# EAGLE design CSv1_LoRa_exp_board (EAGLE 9.5.1)
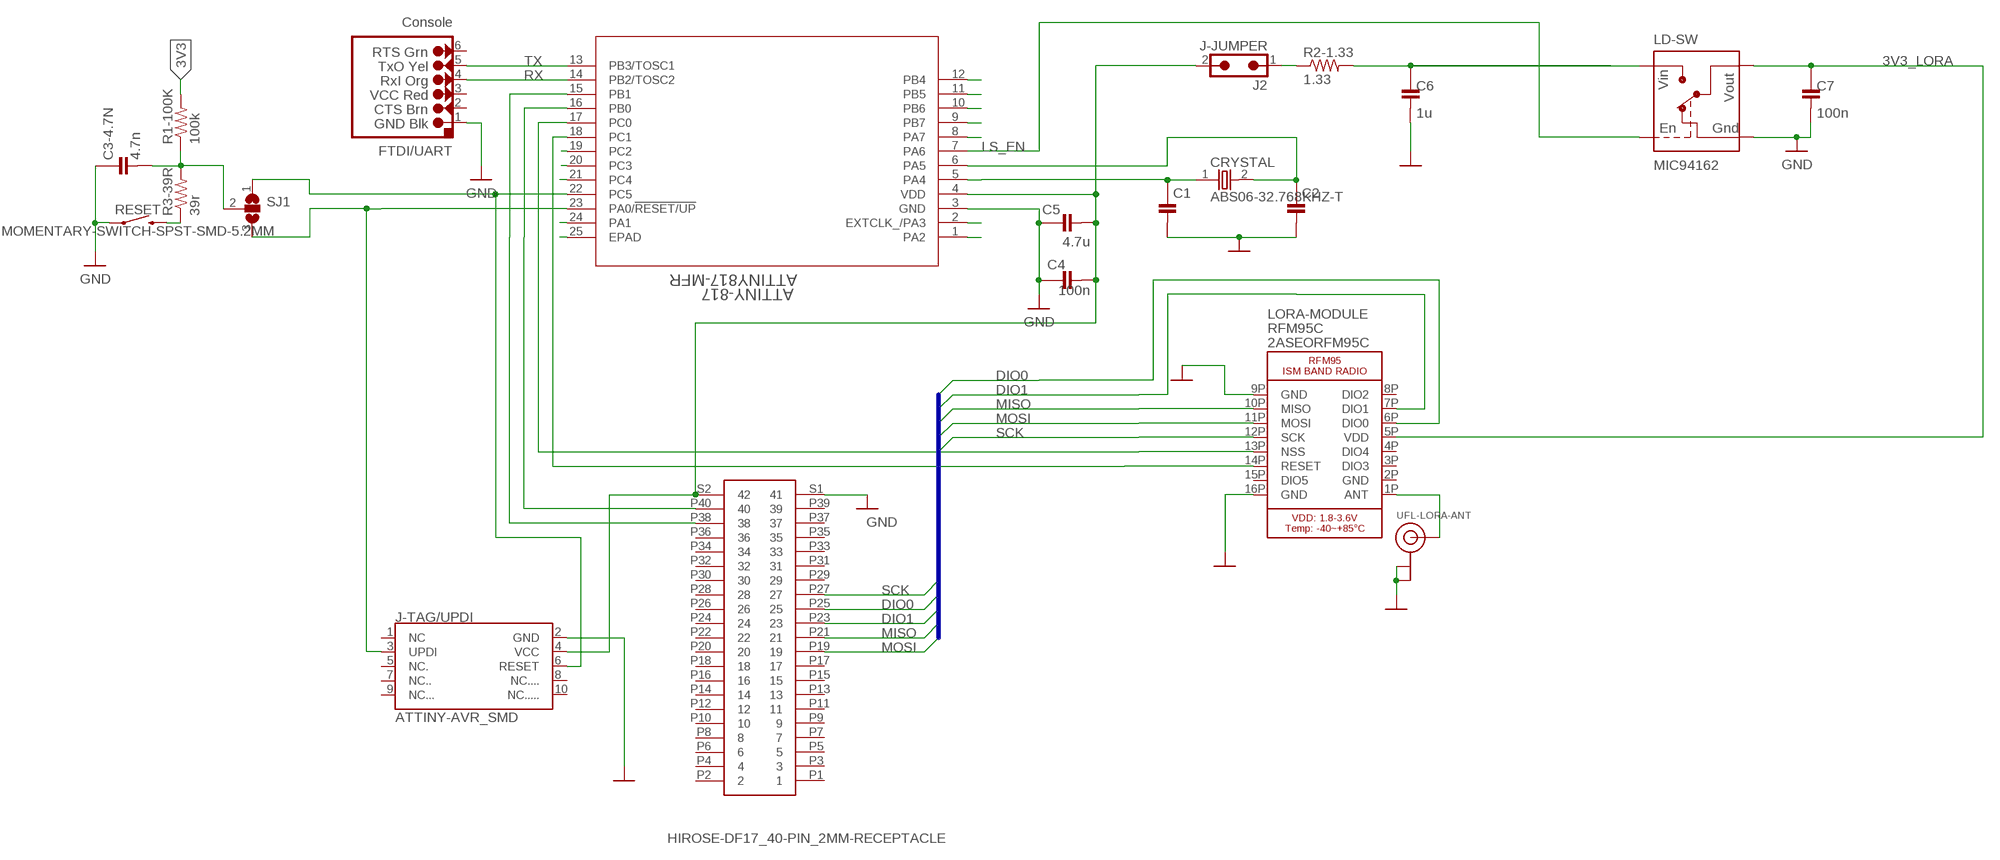
[diagram p0: schematic, sheet 1]

## Parts
ATTINY-817  ATTINY817-MFR  [QFN24_4X4MC]
C1  C-0402  [C0402]
C2  C-0402  [C0402]
C3-4.7N  4.7n  C-0603  [C0603]
C4  100n  C-0402  [C0402]
C5  4.7u  C-0402  [C0402]
C6  1u  C-0402  [C0402]
C7  100n  C-0402  [C0402]
CRYSTAL  ABS06-32.768KHZ-T  [XTAL_ABS06-32.768KHZ-T]
FTDI/UART  J-SERIAL-PORT  [HEADER-1X6]
J1  HIROSE-DF17_40-PIN_2MM-RECEPTACLE  HIROSE-DF17_40-PIN_CONNECTORS-HRS_DF17-40PIN-PLUG  [HRS_DF17-40PIN-PLUG]
J2  J-JUMPER  [HEADER-1X2]
J-TAG/UPDI  ATTINY-AVR_SMD  [ATTINY_AVR]
LD-SW  LOADSWITCH-MIC94162  [WLCSP6_2X3]
LORA-MODULE  RFM95C  [RFM-MOD]
R1-100K  100k  R-0603  [R0603]
R2-1.33  1.33  R-0603  [R0603]
R3-39R  39r  R-0603  [R0603]
RESET  MOMENTARY-SWITCH-SPST-SMD-5.2MM  [TACTILE_SWITCH_SMD_5.2MM]
SJ1  SJ2WW  [SJ_2W]
UFL-LORA-ANT  J-U.FL  [U.FL]

## Nets
3V3 [power_3v3]: ATTINY-817.4(VDD) C4.2 C5.2 J1.S2 J2.2 J-TAG/UPDI.4(VCC) R1-100K.2
3V3_LORA [power_3v3]: C7.1 LD-SW.A1(VOUT) LD-SW.B1(VOUT) LORA-MODULE.5P(VDD)
3V_LD_SW [power_3v3]: C6.1 LD-SW.A2(VIN) LD-SW.B2(VIN) R2-1.33.2
DIO0: J1.P25 LORA-MODULE.6P(DIO0)
DIO1: J1.P23 LORA-MODULE.7P(DIO1)
EPAD: ATTINY-817.25(EPAD)
GND [power_3v3]: ATTINY-817.3(GND) C1.2 C2.2 C3-4.7N.1 C4.1 C5.1 C6.2 C7.2 FTDI/UART.1(GND) J1.S1 J-TAG/UPDI.2(GND) LD-SW.C1(GND) LORA-MODULE.9P(GND) LORA-MODULE.16P(GND) RESET.1 UFL-LORA-ANT.1(GND) UFL-LORA-ANT.2(GND)
LORA_JMP1 [power_3v3]: J2.1 R2-1.33.1
LS_EN: ATTINY-817.7(PA6) LD-SW.C2(ENABLE)
MISO: J1.P21 LORA-MODULE.10P(MISO)
MOSI: J1.P19 LORA-MODULE.11P(MOSI)
N$6: LORA-MODULE.1P(ANT) UFL-LORA-ANT.3(SIGNAL)
N$12: R3-39R.1 RESET.3
N$13: C3-4.7N.2 R1-100K.1 R3-39R.2 SJ1.2
PA0: ATTINY-817.23(PA0/!RESET/UP) J-TAG/UPDI.3(UPDI) SJ1.3
PA1: ATTINY-817.24(PA1)
PA2: ATTINY-817.1(PA2)
PA3: ATTINY-817.2(EXTCLK_/PA3)
PA4: ATTINY-817.5(PA4) C1.1 CRYSTAL.1
PA5: ATTINY-817.6(PA5) C2.1 CRYSTAL.2
PA7: ATTINY-817.8(PA7)
PB0: ATTINY-817.16(PB0) J1.P40
PB4: ATTINY-817.12(PB4)
PB5: ATTINY-817.11(PB5)
PB6: ATTINY-817.10(PB6)
PB7: ATTINY-817.9(PB7)
PC0: ATTINY-817.17(PC0) LORA-MODULE.13P(NSS)
PC1: ATTINY-817.18(PC1) LORA-MODULE.14P(RESET)
PC2: ATTINY-817.19(PC2)
PC3: ATTINY-817.20(PC3)
PC4: ATTINY-817.21(PC4)
PC5: ATTINY-817.22(PC5) J-TAG/UPDI.6(RESET) SJ1.1
RX: ATTINY-817.14(PB2/TOSC2) FTDI/UART.4(RX-I)
SCK: J1.P27 LORA-MODULE.12P(SCK)
SDA: ATTINY-817.15(PB1) J1.P38
TX: ATTINY-817.13(PB3/TOSC1) FTDI/UART.5(TX-O)
Unconnected: FTDI/UART.2(CTS-O) FTDI/UART.3(VCC-I) FTDI/UART.6(RTS) J1.P1 J1.P2 J1.P3 J1.P4 J1.P5 J1.P6 J1.P7 J1.P8 J1.P9 J1.P10 J1.P11 J1.P12 J1.P13 J1.P14 J1.P15 J1.P16 J1.P17 J1.P18 J1.P20 J1.P22 J1.P24 J1.P26 J1.P28 J1.P29 J1.P30 J1.P31 J1.P32 J1.P33 J1.P34 J1.P35 J1.P36 J1.P37 J1.P39 J-TAG/UPDI.1(NC) J-TAG/UPDI.5(NC.) J-TAG/UPDI.7(NC..) J-TAG/UPDI.8(NC....) J-TAG/UPDI.9(NC...) J-TAG/UPDI.10(NC.....) LORA-MODULE.3P(DIO3) LORA-MODULE.4P(DIO4) LORA-MODULE.8P(DIO2) LORA-MODULE.15P(DIO5)

## Buses
DIO0,DIO1,MISO,MOSI,SCK

## Power pins joined to a net without a drawn wire
GND: LORA-MODULE.2P(GND)

## Library data of the parts
ATTINY-817 = ATTINY817-MFRQFN24_RX4MC-L:ATTINY817-MFR; MANUFACTURER_PART_NUMBER: ATTINY817MFR; VENDOR: Microchip
C1 C2 C3-4.7N = Capacitors:C-: Capacitor, Surface Mount; MANUFACTURER: Kemet; TC: X7R; TOL: 10%; VOLTAGE: 6.3V
C4-C6 = Capacitors:C-: Capacitor, Surface Mount; MANUFACTURER: Kemet; PARTNO: CC0402KRX5R5BB105; TC: X7R; TOL: 10%; VOLTAGE: 6.3V
C7 = Capacitors:C-: Capacitor, Surface Mount; MANUFACTURER: Kemet; PARTNO: CC0402KRX5R5BB104; TC: X7R; TOL: 10%; VOLTAGE: 6.3V
CRYSTAL = Oscillators:ABS06-32.768KHZ-T: ABS06 Series 32.768 kHz ±10 ppm 9 pF -40 to +85 °C SMT Low Profile Crystal. Footprint verified by Reese Grimsley; DESCRIPTION: ABS06 Series 32.768 kHz ±10 ppm 12.5 pF -40 to +85 °C SMT Low Profile Crystal; DIGI-KEY_PART_NUMBER: 535-10247-1-ND; DIGI-KEY_PURCHASE_URL: https://www.digikey.com/product-detail/en/abracon-llc/ABS06-32.768KHZ-9-1-T/535-10247-1-ND/2218060; MF: Abracon; MP: ABS06-32.768KHZ-9-1-T ABS06-32.768KHZ-9-1-T; PACKAGE: SMD-2 Abracon
FTDI/UART = Connectors:J-SERIAL-PORT: An Arduino-style serial port connector. Mates with the corresponding FTDI USB Serial cable. The attribute "DESCRIPTION" can be set to a string that will show on the schematic and the silkscreen.; DESCRIPTION: Console; MANUFACTURER: Metz Connect USA; MPN: PR20C06VBNN
J1 = Connectors:HIROSE-DF17_40-PIN_CONNECTORS: Hirose DF17 Series 0.5mm Pitch 40 Way 2 Row Straight PCB Socket, Surface Mount, Solder Termination Updated Footprints: ###-PLUG, ###-SOCKETS (pins are mirrored L/R) Footprints apply to all heights (e.g. HRS_DF17(#.#)-40D....) Updated by Scotty 18NOV2019 Source: Datasheet <https://componentsearchengine.com/Datasheets/1/DF17(4.0)-40DS-0.5V(57).pdf>
J2 = Connectors:J-JUMPER: JUMPER; DESCRIPTION: JMP_LORA
J-TAG/UPDI = scotty:ATTINY-AVR: Cortex Debug Connector - 10 pin Supports JTAG debug, Serial Wire debug, and Serial Wire Viewer. PTH and SMD connector options available. General Connector Information <http://infocenter.arm.com/help/topic/com.arm.doc.faqs/attached/13634/cortex_debug_connectors.pdf> Products: PTH Connector <http://www.digikey.com/product-detail/en/cnc-tech/3220-10-0100-00/1175-1627-ND/3883661> -via Digi-Key SparkFun PSoc <https://www.sparkfun.com/products/13229> SparkFun T <https://www.sparkfun.com/products/13810>; MANUFACTURER: Samtech Inc.; MPN: FTSH-105-01-L-DV-K-TR
LD-SW = Switches:LOADSWITCH-MIC9416: MICREL 3A HIGH-SIDE LOAD SWITCH WITH REVERSE BLOCKING http://ww1.microchip.com/downloads/en/DeviceDoc/MIC9416x.pdf https://www.digikey.com/product-detail/en/microchip-technology/MIC94162YCS-TR/576-4508-1-ND/4732487; MANUFACTURER: Microchip Technology; MPN: MIC94162YCS-TR; PARTNO: MIC94162; QUENCH: YES; SOFTSTART: NO
LORA-MODULE = Radios:RFM95: RFM95 - ISM Band LoRa Transceiver; FCC: 2ASEORFM95C; MANUFACTURER: HopeRF; MPN: RFM95C
R1-100K R3-39R = Resistors:R-: Resistor, Surface Mount; MANUFACTURER: Panasonic; TOL: 5%
R2-1.33 = Resistors:R-: Resistor, Surface Mount; MANUFACTURER: Panasonic; PARTNO: CRCW06031R33FKEA; TOL: 5%
RESET = Switches:MOMENTARY-SWITCH-SPST: Momentary Switch (Pushbutton) - SPST Normally-open (NO) SPST momentary switches (buttons, pushbuttons). Variants PTH-12MM - 12mm square, through-hole Momentary Pushbutton Switch - 12mm Square <https://www.sparkfun.com/products/9190> (COM-09190) PTH-6.0MM, PTH-6.0MM-KIT - 6.0mm square, through-hole Mini Pushbutton Switch <https://www.sparkfun.com/products/97> (COM-00097) KIT package intended for soldering kit's - only one side of pads' copper is exposed. PTH-RIGHT-ANGLE-KIT - Right-angle, through-hole Right Angle Tactile Button <https://www.sparkfun.com/products/10791> - Used on SparkFun BigTime Watch Kit <https://www.sparkfun.com/products/11734> SMD-12MM - 12mm square, surface-mount Tactile Button - SMD (12mm) <https://www.sparkfun.com/products/12993> (COM-12993) Used on SparkFun PicoBoard <https://www.sparkfun.com/products/11888> SMD-4.5MM - 4.5mm Square Trackball Switch Used on SparkFun Blackberry Trackballer Breakout <https://www.sparkfun.com/products/13169> SMD-4.6MMX2.8MM - 4.60mm x 2.80mm, surface mount Used on SparkFun SAMD21 Mini Breakout <https://www.sparkfun.com/products/13664> SMD-5.2MM, SMD-5.2-REDUNDANT - 5.2mm square, surface-mount Mini Pushbutton Switch - SMD <https://www.sparkfun.com/products/8720> (COM-08720) Used on Arduino Pro Mini <https://www.sparkfun.com/products/11114> REDUNDANT package connects both switch circuits together SMD-6.0X3.5MM - 6.0 x 3.5mm, surface mount Momentary Reset Switch SMD <https://www.sparkfun.com/products/8229> (COM-08229) SMD-6.2MM-TALL - 6.2mm square, surface mount Tactile Button - SMD (6mm) <https://www.sparkfun.com/products/12992> Used on SparkFun Digital Sandbox <https://www.sparkfun.com/products/12651> SMD-RIGHT-ANGLE - Right-angle, surface mount Used on SparkFun Block for Intel® Edison - Arduino <https://www.sparkfun.com/products/13036>; PROD_ID: COMP-12265; SF_SKU: COM-12993
SJ1 = jumper:SJ2W: SMD solder JUMPER
UFL-LORA-ANT = Connectors:J-U.FL: U.FL Antenna Connector

## Net classes
1 power_3v3: width 0.305 mm
2 power_5: width 0.305 mm
3 50_ohm: width 0.279 mm
4 power_bat: width 0.305 mm
5 10_mil: width 0.254 mm

## Board
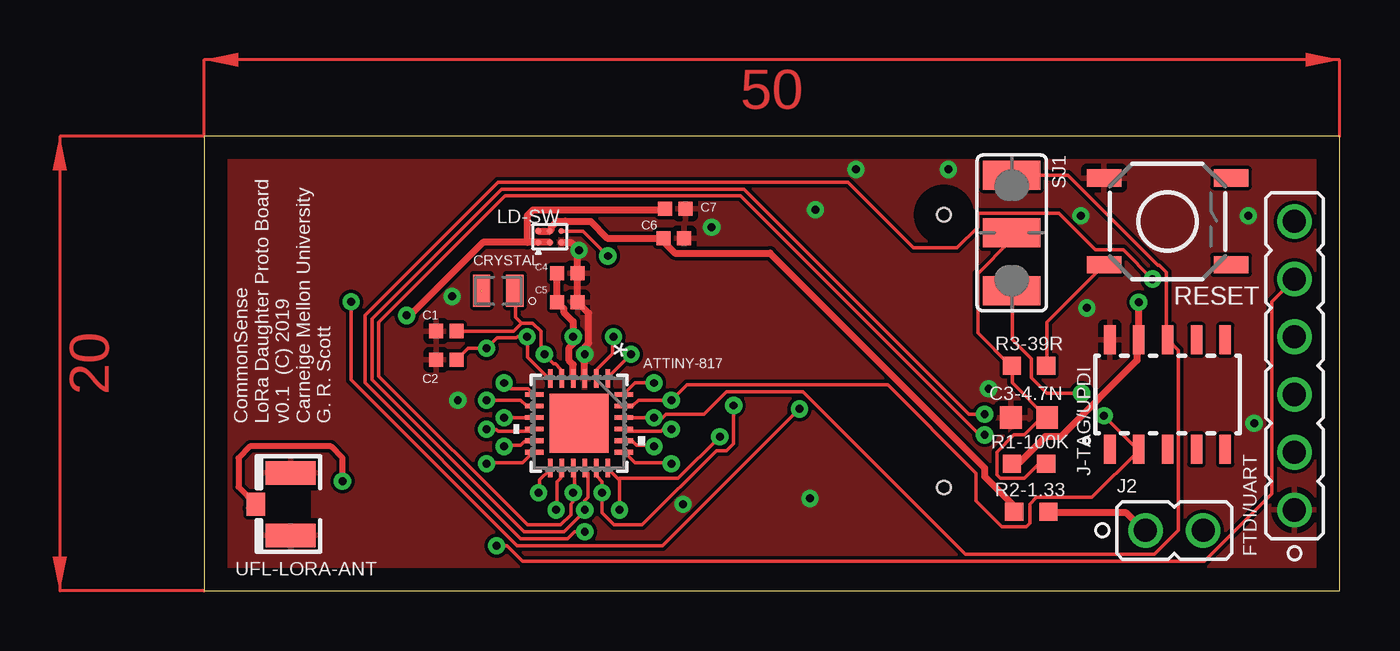
[diagram p1: board, top side]
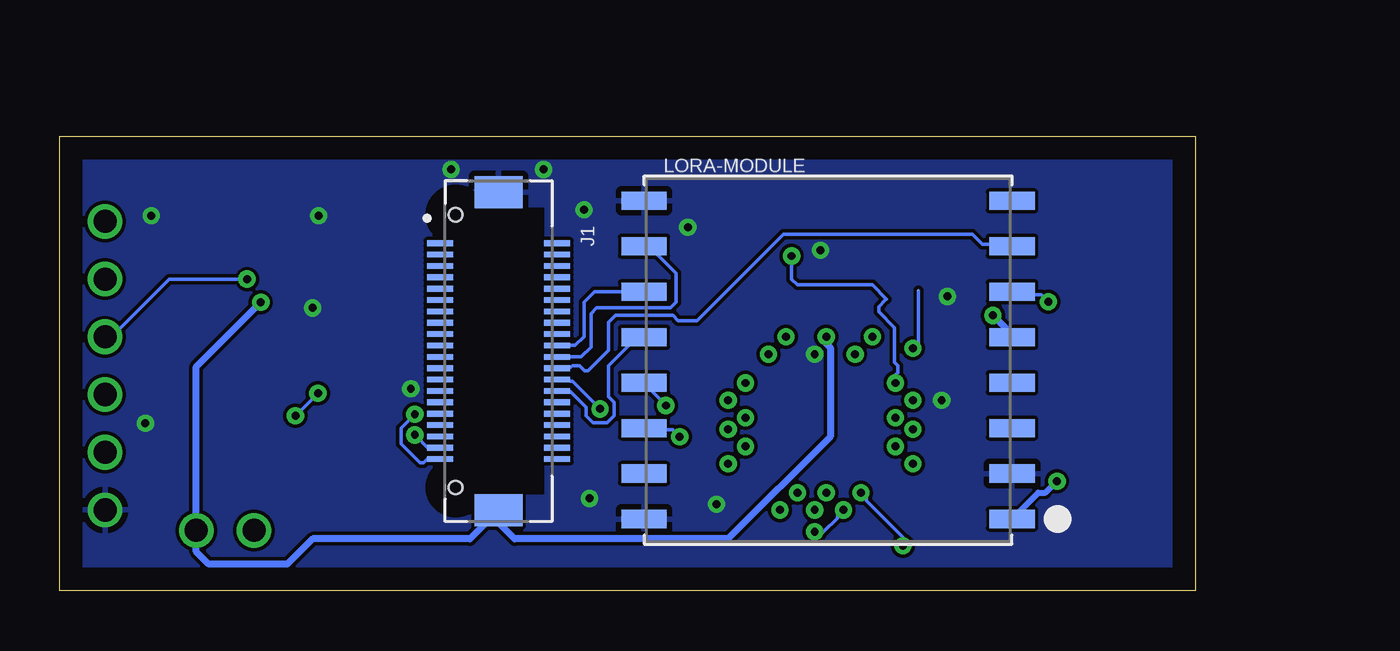
[diagram p2: board, bottom side, seen from below]

Size 50 x 20 mm. Coordinates in mm from the lower left corner, seen from the top.
Outline: 0,0 50,0 50,20 0,20 0,0
Copper layers (1*16): Top 0.035mm / dielectric 1.5mm / Bottom 0.035mm
Design rules "default": minimum track width 6mil, minimum drill 0.35mm, track to track 6mil, track to pad 6mil, pad to pad 6mil, via to via 6mil, smd to smd 6mil, copper to edge 40mil, drill to drill 6mil, minimum pad ring 10mil, minimum via ring 8mil, stop-mask expansion 4mil, vias tented up to drill 0mil, thermal gap 10mil

### Footprints (pad centres in the part's own frame; a part is rotated, then mirrored left to right if it is on the bottom)
QFN24_4X4MC = smd 0.813 x 0.203: 1 -1.968,1.27; 2 -1.968,0.762; 3 -1.968,0.254; 4 -1.968,-0.254; 5 -1.968,-0.762; 6 -1.968,-1.27; 13 1.968,-1.27; 14 1.968,-0.762; 15 1.968,-0.254; 16 1.968,0.254; 17 1.968,0.762; 18 1.968,1.27 | smd 0.203 x 0.813: 7 -1.27,-1.968; 8 -0.762,-1.968; 9 -0.254,-1.968; 10 0.254,-1.968; 11 0.762,-1.968; 12 1.27,-1.968; 19 1.27,1.968; 20 0.762,1.968; 21 0.254,1.968; 22 -0.254,1.968; 23 -0.762,1.968; 24 -1.27,1.968 | smd 2.591 x 2.591: 25 0,0
C0402 = smd 0.62 x 0.62: 1 -0.45,0; 2 0.45,0
C0603 = smd 0.95 x 1: 1 -0.8,0; 2 0.8,0
XTAL_ABS06-32.768KHZ-T = smd 0.75 x 1.4: 1 -0.73,0; 2 0.73,0
HEADER-1X6 = drill 1.016: 1 0,-6.35; 2 0,-3.81; 3 0,-1.27; 4 0,1.27; 5 0,3.81; 6 0,6.35
HRS_DF17-40PIN-PLUG = smd 0.25 x 1.15: P1 -4.75,2.575; P2 -4.75,-2.575; P3 -4.25,2.575; P4 -4.25,-2.575; P5 -3.75,2.575; P6 -3.75,-2.575; P7 -3.25,2.575; P8 -3.25,-2.575; P9 -2.75,2.575; P10 -2.75,-2.575; P11 -2.25,2.575; P12 -2.25,-2.575; P13 -1.75,2.575; P14 -1.75,-2.575; P15 -1.25,2.575; P16 -1.25,-2.575; P17 -0.75,2.575; P18 -0.75,-2.575; P19 -0.25,2.575; P20 -0.25,-2.575; P21 0.25,2.575; P22 0.25,-2.575; P23 0.75,2.575; P24 0.75,-2.575; P25 1.25,2.575; P26 1.25,-2.575; P27 1.75,2.575; P28 1.75,-2.575; P29 2.25,2.575; P30 2.25,-2.575; P31 2.75,2.575; P32 2.75,-2.575; P33 3.25,2.575; P34 3.25,-2.575; P35 3.75,2.575; P36 3.75,-2.575; P37 4.25,2.575; P38 4.25,-2.575; P39 4.75,2.575; P40 4.75,-2.575 | smd 1.4 x 2.1: S1 -7,0; S2 7,0 | hole 0.6: -6,-1.9; 6,-1.9
HEADER-1X2 = drill 1.016: 1 0,-1.27; 2 0,1.27
ATTINY_AVR = smd 0.508 x 1.27: 1 -2.54,-2.413; 2 -2.54,2.413; 3 -1.27,-2.413; 4 -1.27,2.413; 5 0,-2.413; 6 0,2.413; 7 1.27,-2.413; 8 1.27,2.413; 9 2.54,-2.413; 10 2.54,2.413
WLCSP6_2X3 = smd 0.254 x 0.254: A1 -0.25,0.5; A2 0.25,0.5; B1 -0.25,0; B2 0.25,0; C1 -0.25,-0.5; C2 0.25,-0.5
RFM-MOD = smd 2 x 0.8: 1P 8.1,-7; 2P 8.1,-5; 3P 8.1,-3; 4P 8.1,-1; 5P 8.1,1; 6P 8.1,3; 7P 8.1,5; 8P 8.1,7; 9P -8.1,7; 10P -8.1,5; 11P -8.1,3; 12P -8.1,1; 13P -8.1,-1; 14P -8.1,-3; 15P -8.1,-5; 16P -8.1,-7
R0603 = smd 0.8 x 0.8: 1 -0.75,0; 2 0.75,0
TACTILE_SWITCH_SMD_5.2MM = smd 1.524 x 0.762: 1 -2.794,1.905; 2 2.794,1.905; 3 -2.794,-1.905; 4 2.794,-1.905
SJ_2W = smd 1.27 x 2.54: 1 -2.54,0; 2 0,0; 3 2.54,0
U.FL = smd 2.2 x 1.05: 1 0,1.375; 2 0,-1.375 | smd 0.8 x 1: 3 1.525,0

### Placement (x,y rotation side)
ATTINY-817  16.51,7.37 270 top
C1  10.67,11.43 180 top
C2  10.67,10.16 180 top
C3-4.7N  36.32,7.62 0 top
C4  16,13.97 180 top
C5  16,12.7 180 top
C6  20.68,15.52 0 top
C7  20.75,16.81 0 top
CRYSTAL  12.95,13.21 180 top
FTDI/UART  48.01,9.91 0 top
J1  30.68,10.54 270 bottom
J2  42.72,2.66 270 top
J-TAG/UPDI  42.42,8.64 0 top
LD-SW  15.22,15.58 90 top
LORA-MODULE  16.18,10.16 0 bottom
R1-100K  36.32,5.59 180 top
R2-1.33  36.42,3.48 180 top
R3-39R  36.32,9.91 180 top
RESET  42.42,16.26 0 top
SJ1  35.56,15.75 270 top
UFL-LORA-ANT  3.81,3.81 180 top

### Tracks (layer width: path | path; a pad name or v marks a point on that pad's centre or on a via)
3V3  (via drill 0.35)
  Top 0.305: ATTINY-817.4 16.26,9.96 16.08,10.13 16.08,10.7 16.26,10.87 v16.26,11.18 16.26,11.85 15.84,12.26 15.84,12.41 C5.2 C4.2 | v41.15,12.7 J-TAG/UPDI.4 41.07,10.97 41.07,10.13 37.72,6.78 37.03,6.78 35.89,5.64 35.59,5.64 R1-100K.2
  Bottom 0.305: v16.26,11.18 16.26,10.87 16.08,10.7 16.08,6.78 20.57,2.29 29.97,2.29 30.68,2.99 J1.S2 31.94,2.29 38.86,2.29 39.98,1.17 43.43,1.17 43.99,1.72 J2.2 43.99,9.86 v41.15,12.7
3V3_LORA  (via drill 0.35)
  Top 0.305: C7.1 20.25,16.76 14.48,16.76 14.22,16.51 14.22,15.33 | 14.22,15.33 12.28,15.33 8.99,12.04 v8.91,12.12 | LD-SW.B1 LD-SW.A1 14.22,15.33
  Bottom 0.305: v8.91,12.12 8.15,11.35 8.15,11.2 LORA-MODULE.5P
3V_LD_SW
  Top 0.305: LD-SW.A2 LD-SW.B2 15.29,15.9 15.29,16.01 15.54,16.26 15.9,16.26 15.91,16.26 17.02,16.26 17.75,15.52 C6.1 20.19,15.39 20.73,14.86 24.92,14.86 34.37,5.41 34.37,5.03 35.66,3.73 35.66,3.5 R2-1.33.2
DIO0  (via drill 0.35)
  Top 0.152: v26.21,8 20.19,1.98 13.79,1.98 6.48,9.3 v6.48,12.72
  Bottom 0.152: v26.21,8 27.43,9.22 27.51,9.22 27.58,9.3 28.04,9.3 J1.P25 | v6.48,12.72 6.78,13.03 8,13.03 8.08,13.11 LORA-MODULE.6P
DIO1
  Bottom 0.152: J1.P23 28.04,9.83 27.51,9.83 27.43,9.91 27.13,9.91 26.9,9.68 26.75,9.68 25.83,10.59 25.83,11.81 25.53,12.12 23.01,12.12 22.78,11.89 21.95,11.89 18.14,15.7 9.83,15.7 9.37,15.24 8.23,15.24 8.15,15.16 LORA-MODULE.7P
GND  (via drill 0.35)
  Top 0.305: ATTINY-817.3 v16.76,10.41 16.76,10.72 16.94,10.89 16.94,12.21 C5.1 C4.1 16.45,14.93 v16.51,14.99 16.16,15.33 LD-SW.C1
  other vias: 28.7,18.54 32.77,18.54 45.97,16.51 11.18,8.38 10.92,12.95 21.08,3.81 38.61,16.51 46.23,7.37 38.86,12.45 34.54,8.89 22.35,16 26.92,16.76 26.67,4.06
  pour Top: -1.52,21.59 50.8,21.59 51.31,21.08 51.31,-1.02 50.8,-1.52 -1.27,-1.52 -2.03,-0.76 -2.03,21.08
  pour Bottom: -2.54,22.35 51.31,22.35 52.07,21.59 52.07,-1.78 51.49,-2.36 -2.54,-2.36
LORA_JMP1
  Top 0.305: R2-1.33.1 37.19,3.43 40.62,3.43 41.38,2.67 J2.1
LS_EN  (via drill 0.35)
  Top 0.152: LD-SW.C2 16.68,15.83 v17.78,14.73 | v13.21,9.14 13.26,9.14 13.51,8.89 14.28,8.89 14.48,8.69 ATTINY-817.7
  Bottom 0.152: v17.78,14.73 17.78,13.72 17.53,13.46 14.48,13.46 14.22,13.46 13.6,12.84 13.64,12.8 13.95,12.5 13.95,12.27 13.26,11.58 13.26,10.06 13.11,9.91 13.11,9.6 13.18,9.53 13.18,9.14 v13.21,9.14
MISO
  Bottom 0.152: J1.P21 27.04,10.29 26.62,10.72 26.62,12.19 26.36,12.45 23.11,12.45 22.86,12.7 22.86,13.97 24.05,15.16 LORA-MODULE.10P
MOSI
  Bottom 0.152: J1.P19 27.31,10.79 26.92,11.18 26.92,12.7 26.47,13.16 LORA-MODULE.11P
N$6  (via drill 0.35)
  Top 0.152: 1.93,3.63 UFL-LORA-ANT.3
  Top 0.254: v6.1,4.83 6.1,5.84 5.59,6.35 2.03,6.35 1.52,5.84 1.52,4.57 UFL-LORA-ANT.3
  Bottom 0.152: 8.08,3.2 LORA-MODULE.1P
  Bottom 0.254: LORA-MODULE.1P 6.92,4.32 6.6,4.32 v6.1,4.83
N$12
  Top 0.152: R3-39R.1 37.11,9.91 37.11,11.81 39.62,14.33 RESET.3
N$13
  Top 0.152: R1-100K.1 37.03,5.56 36.73,5.56 36.12,4.95 35.05,4.95 34.9,5.11 34.9,6.1 35.66,6.86 36.12,6.86 36.96,7.7 C3-4.7N.2 35.59,9.14 35.59,9.91 R3-39R.2 35.51,9.91 34.06,11.35 34.06,13.95 35.51,15.39 35.51,15.7 SJ1.2
PA0  (via drill 0.35)
  Top 0.152: ATTINY-817.23 18.52,8.15 18.9,8.15 19.13,8.38 v20.57,8.38 21.26,9.07 30.1,9.07 33.98,5.18 33.98,3.96 35.13,2.82 36.2,2.82 36.35,2.97 36.35,3.81 36.65,4.12 39.09,4.12 41.15,6.17 | 41.15,6.17 J-TAG/UPDI.3 41.15,6.17 | v38.63,8.69 37.11,8.69 36.42,9.37 36.42,10.21 35.59,11.05 35.59,13.18 SJ1.3 | 41.15,6.17 v39.62,7.7
  Bottom 0.152: v39.62,7.7 v38.63,8.69
PA1  (via drill 0.35)
  Top 0.152: v19.81,9.14 18.97,9.14 18.52,8.69 ATTINY-817.24
PA2  (via drill 0.35)
  Top 0.152: v18.8,10.41 18.75,10.36 17.75,9.37 ATTINY-817.1
PA3  (via drill 0.35)
  Top 0.152: v18.03,11.18 17.98,11.12 17.98,10.44 17.3,9.75 17.3,9.37 ATTINY-817.2
PA4  (via drill 0.35)
  Top 0.152: ATTINY-817.5 15.7,9.37 15.7,9.75 15.47,9.98 15.39,9.98 15.01,10.36 v14.99,10.41 14.83,10.57 14.83,11.43 14.47,11.78 13.97,11.78 | C1.1 13.62,11.43 13.97,11.78 | CRYSTAL.1 13.72,13.18 13.72,12.04 13.95,11.81 13.97,11.78
PA5  (via drill 0.35)  (1 unrouted)
  Top 0.152: ATTINY-817.6 15.24,9.3 14.25,10.29 14.25,11.12 v14.22,11.18 13.8,11.18 | 13.8,11.18 13.75,11.12 | 12.04,13.18 12.19,13.18 CRYSTAL.2 | 11.05,9.98 11.05,10.13 C2.1 11.63,10.67 v12.45,10.67 12.9,11.12 13.75,11.12 | 13.75,11.12 13.8,11.18
  Bottom 0.152: v12.45,10.67 12.19,10.92 12.19,13.21
PA7  (via drill 0.35)
  Top 0.152: v12.45,8.38 12.5,8.38 13.95,8.38 14.17,8.15 14.48,8.15 ATTINY-817.8
PB0  (via drill 0.35)
  Top 0.152: ATTINY-817.16 16.76,5.33 16.92,5.18 16.92,4.12 16.76,3.96 16.76,3.58 v16.76,3.56 16.76,3.5 15.85,2.59 14.1,2.59 7.39,9.3 7.39,11.96 13.11,17.68 23.77,17.68 33.68,7.77 v34.37,7.77
  Bottom 0.152: v34.37,7.77 34.98,7.16 34.98,6.48 34.14,5.64 33.98,5.64 33.83,5.79 33.3,5.79 J1.P40
PB4  (via drill 0.35)
  Top 0.152: v12.45,5.59 12.5,5.64 14.02,5.64 14.48,6.1 ATTINY-817.12
PB5  (via drill 0.35)
  Top 0.152: v13.21,6.35 13.26,6.4 13.95,6.4 14.1,6.55 14.48,6.55 ATTINY-817.11
PB6  (via drill 0.35)
  Top 0.152: v12.45,7.11 12.5,7.09 12.88,7.09 12.95,7.01 14.4,7.01 14.48,7.09 ATTINY-817.10
PB7  (via drill 0.35)
  Top 0.152: v13.21,7.62 13.26,7.62 14.48,7.62 ATTINY-817.9
PC0  (via drill 0.35)
  Top 0.152: ATTINY-817.17 17.3,5.33 17.3,5.03 17.53,4.8 17.53,4.34 v17.53,4.32 17.53,4.27 17.53,3.43 18.06,2.9 19.28,2.9 22.55,6.17 23.01,6.17 23.32,6.48 v23.32,8.15
  Bottom 0.152: v23.32,8.15 24.31,9.14 LORA-MODULE.13P
PC1  (via drill 0.35)
  Top 0.152: 18.25,4.92 17.83,5.33 ATTINY-817.18 | 18.25,4.92 18.29,4.88 18.29,3.58 v18.29,3.56 | v22.71,6.78 20.88,4.95 18.29,4.95 18.25,4.92
  Bottom 0.152: v22.71,6.78 23.01,7.09 24.23,7.09 LORA-MODULE.14P
PC2  (via drill 0.35)
  Top 0.152: v20.57,5.59 20.57,5.64 18.97,5.64 18.52,6.1 ATTINY-817.19
PC3  (via drill 0.35)
  Top 0.152: v19.81,6.35 19.81,6.4 19.05,6.4 18.9,6.55 18.52,6.55 ATTINY-817.20
PC4  (via drill 0.35)
  Top 0.152: v20.57,7.11 20.57,7.09 20.19,7.09 20.12,7.01 18.59,7.01 18.52,7.09 ATTINY-817.21
PC5  (via drill 0.35)
  Top 0.152: ATTINY-817.22 18.52,7.62 v19.81,7.62 20.19,7.62 20.34,7.77 22.02,7.77 23.01,8.76 26.36,8.76 33.53,1.6 41.83,1.6 42.9,2.67 42.9,10.59 42.44,11.05 J-TAG/UPDI.6 42.37,11.05 42.37,14.02 42.06,14.33 41.99,14.33 38.02,18.29 35.59,18.29 SJ1.1
RX  (via drill 0.35)
  Top 0.152: v15.49,3.56 15.54,3.58 15.54,4.8 15.7,4.95 15.7,5.33 ATTINY-817.14 | v16.76,2.59 16.31,2.59 16,2.29 13.95,2.29 7.09,9.14 7.09,12.12 12.95,17.98 28.35,17.98 31.24,15.09 33.15,15.09 34.06,16 34.06,16.54 34.14,16.61 37.64,16.61 39.24,15.01 40.46,15.01 v41.76,13.72
  Bottom 0.152: v16.76,2.59 16.38,2.59 15.77,3.2 15.77,3.28 15.54,3.5 v15.49,3.56 | v41.76,13.72 45.19,13.72 47.7,11.2 48.01,11.2 FTDI/UART.4
SCK
  Bottom 0.152: J1.P27 28.04,8.76 27.51,8.76 26.82,8.08 26.82,7.7 26.52,7.39 25.91,7.39 25.6,7.7 25.6,8.31 25.83,8.53 25.83,9.91 24.61,11.12 24.31,11.12 LORA-MODULE.12P
SDA  (via drill 0.35)
  Top 0.152: ATTINY-817.15 16.31,5.33 16.31,4.34 v16.26,4.32 16.23,4.27 16.23,3.89 16.15,3.81 16.15,3.35 15.7,2.9 14.25,2.9 7.7,9.45 7.7,11.81 13.26,17.37 23.62,17.37 34.14,6.86 v34.37,6.86
  Bottom 0.152: v34.37,6.86 33.76,6.25 33.3,6.25 J1.P38
TX  (via drill 0.35)
  Top 0.152: v14.73,4.32 14.78,4.34 14.78,4.88 15.24,5.33 ATTINY-817.13 | v12.88,1.98 13.34,1.98 14.02,1.29 44.04,1.29 47.02,4.27 47.02,12.72 FTDI/UART.5
  Bottom 0.152: v12.88,1.98 12.88,2.36 14.48,3.96 14.48,4.04 14.71,4.27 v14.73,4.32
(copper drawn outside any net)
  shapes: Top area x2

### Text on the board
tNames: CommonSense / LoRa Daughter Proto Board / v0.1 (C) 2019 / Carneige Mellon University / G. R. Scott